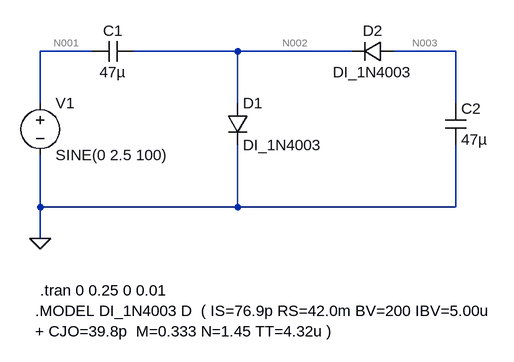
[diagram p0: schematic B1d.asc]
B1d.asc, the LTspice schematic file:
Version 4.1
SHEET 1 880 680
WIRE 96 48 16 48
WIRE 320 48 160 48
WIRE 496 48 320 48
WIRE 656 48 560 48
WIRE 16 128 16 48
WIRE 320 128 320 48
WIRE 656 128 656 48
WIRE 16 288 16 208
WIRE 320 288 320 192
WIRE 320 288 16 288
WIRE 656 288 656 192
WIRE 656 288 320 288
WIRE 16 336 16 288
FLAG 16 336 0
SYMBOL voltage 16 112 R0
WINDOW 123 0 0 Left 0
WINDOW 39 0 0 Left 0
SYMATTR InstName V1
SYMATTR Value SINE(0 2.5 100)
SYMBOL cap 160 32 R90
WINDOW 0 0 32 VBottom 2
WINDOW 3 32 32 VTop 2
SYMATTR InstName C1
SYMATTR Value 47µ
SYMBOL diode 304 128 R0
SYMATTR InstName D1
SYMATTR Value DI_1N4003
SYMBOL diode 560 32 R90
WINDOW 0 0 32 VBottom 2
WINDOW 3 32 32 VTop 2
SYMATTR InstName D2
SYMATTR Value DI_1N4003
SYMBOL cap 640 128 R0
SYMATTR InstName C2
SYMATTR Value 47µ
TEXT 8 448 Left 2 !.MODEL DI_1N4003 D  ( IS=76.9p RS=42.0m BV=200 IBV=5.00u\n+ CJO=39.8p  M=0.333 N=1.45 TT=4.32u )
TEXT 16 416 Left 2 !.tran 0 0.25 0 0.01

The netlist it stands for:
* B1d.asc
V1 N001 0 SINE(0 2.5 100)
C1 N002 N001 47µ
D1 N002 0 DI_1N4003
D2 N003 N002 DI_1N4003
C2 N003 0 47µ
.model D D
.lib standard.dio
.MODEL DI_1N4003 D  ( IS=76.9p RS=42.0m BV=200 IBV=5.00u
+ CJO=39.8p  M=0.333 N=1.45 TT=4.32u )
.tran 0 0.25 0 0.01
.backanno
.end

* Results of the author's LTspice run, read from the files saved beside the schematic
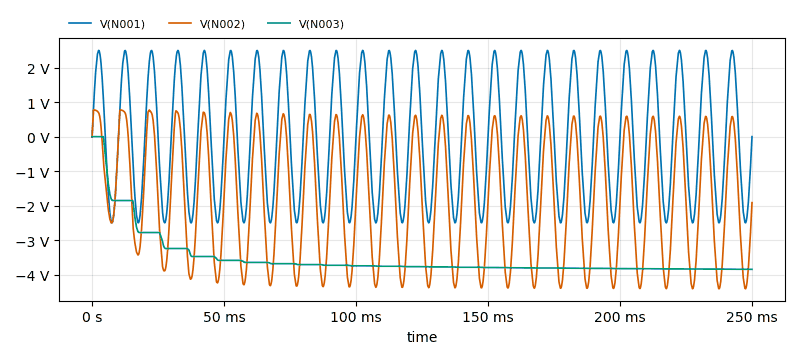
[diagram p1: Transient Analysis of B1d.asc, plotted from the saved traces]
* Transient Analysis, 1 run:
*   V(N001): min -2.5 V, max 2.5 V, average 155.7 µV, rms 1.796 V, last 0 V
*   V(N002): min -4.409 V, max 775.5 mV, average -1.783 V, rms 2.527 V, last -1.912 V
*   V(N003): min -3.844 V, max 593.3 nV, average -3.528 V, rms 3.594 V, last -3.844 V